# EAGLE schematic rfid-shield (EAGLE 6.5.0)
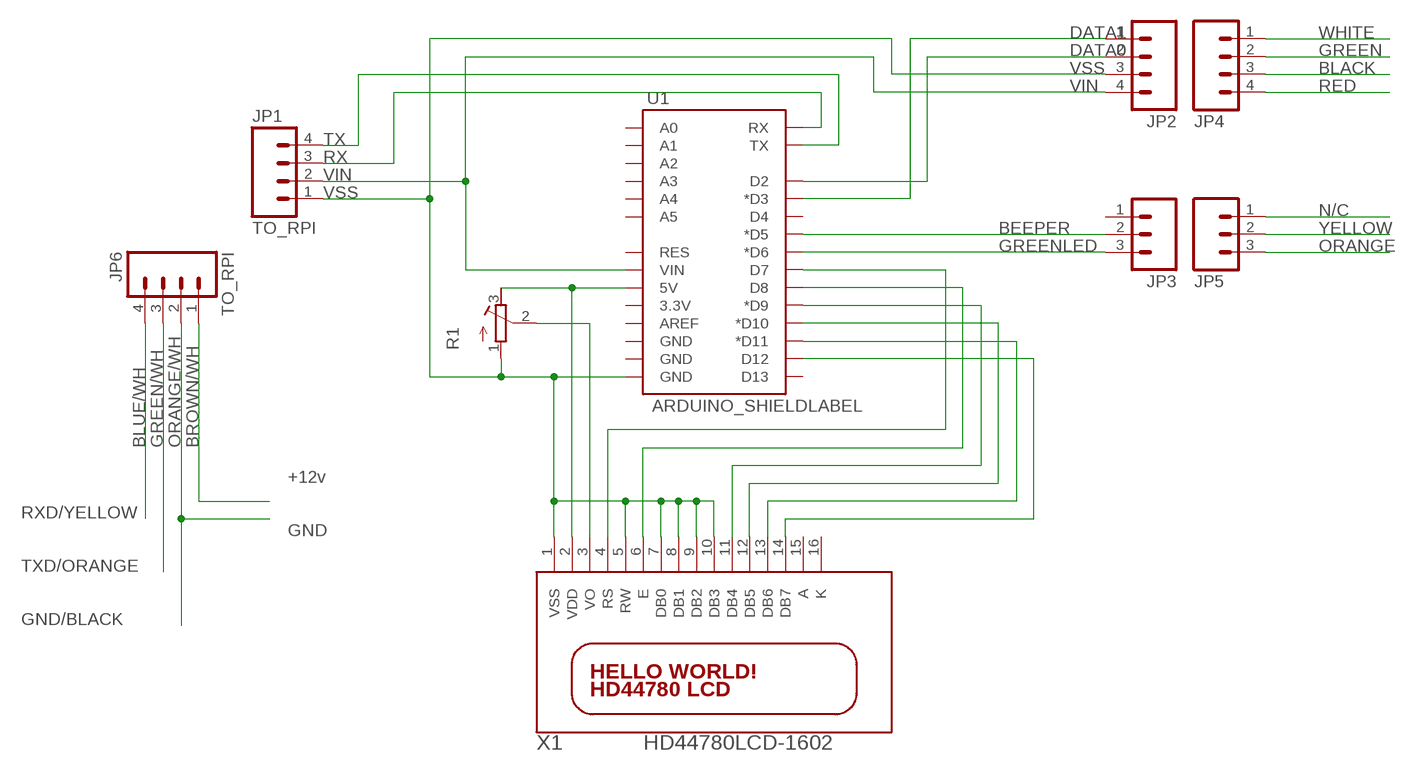
[diagram p0: schematic, sheet 1]

## Parts
JP1  TO_RPI  M041X04_NO_SILK  [1X04_NO_SILK]
JP2  M041X04_NO_SILK  [1X04_NO_SILK]
JP3  M031X03_NO_SILK  [1X03_NO_SILK]
JP4  M041X04_NO_SILK  [1X04_NO_SILK]
JP5  M031X03_NO_SILK  [1X03_NO_SILK]
JP6  TO_RPI  M041X04_NO_SILK  [1X04_NO_SILK]
R1  R-TRIMMCVR42A  [RTRIMCVR42A]
U1  ARDUINO_SHIELDLABEL  [DUEMILANOVE_SHIELD]
X1  HD44780LCD-1602  [LCD1602]

## Nets
BEEPER: JP3.2 U1.D5(*D5)
BLACK: JP4.3
BLUE/WH: JP6.4
BROWN/WH: JP6.1
DATA0: JP2.2 U1.D2
DATA1: JP2.1 U1.D3(*D3)
GREEN: JP4.2
GREEN/WH: JP6.3
GREENLED: JP3.3 U1.D6(*D6)
N$1: U1.D12 X1.14(DB7)
N$2: U1.D11(*D11) X1.13(DB6)
N$3: U1.D10(*D10) X1.12(DB5)
N$4: U1.D9(*D9) X1.11(DB4)
N$5: U1.D8 X1.6(E)
N$6: U1.D7 X1.4(RS)
N$7: R1.2(S) X1.3(VO)
N/C: JP5.1
ORANGE: JP5.3
ORANGE/WH: JP6.2
RED: JP4.4
RX: JP1.3 U1.RX
TX: JP1.4 U1.TX
VDD: R1.3(E) U1.5V X1.2(VDD)
VIN: JP1.2 JP2.4 U1.VIN
VSS: JP1.1 JP2.3 R1.1(A) U1.GND@0(GND) X1.1(VSS) X1.5(RW) X1.7(DB0) X1.8(DB1) X1.9(DB2) X1.10(DB3)
WHITE: JP4.1
YELLOW: JP5.2
Unconnected: JP3.1 U1.3.3V U1.A0 U1.A1 U1.A2 U1.A3 U1.A4 U1.A5 U1.AREF U1.D4 U1.D13 U1.GND@1(GND) U1.GND@2(GND) U1.RES X1.15(A) X1.16(K)

## Notes on the sheet
- +12v
- RXD/YELLOW
- GND
- TXD/ORANGE
- GND/BLACK

## Library data of the parts
JP1 JP2 JP4 JP6 = SparkFun-Connectors:M04: Header 4 Standard 4-pin 0.1" header. Use with straight break away headers (SKU : PRT-00116), right angle break away headers (PRT-00553), swiss pins (PRT-00743), machine pins (PRT-00117), and female headers (PRT-00115). Molex polarized connector foot print use with SKU : PRT-08231 with associated crimp pins and housings. 1MM SMD Version SKU: PRT-10208
JP3 JP5 = SparkFun-Connectors:M03: Header 3 Standard 3-pin 0.1" header. Use with straight break away headers (SKU : PRT-00116), right angle break away headers (PRT-00553), swiss pins (PRT-00743), machine pins (PRT-00117), and female headers (PRT-00115). Molex polarized connector foot print use with SKU : PRT-08232 with associated crimp pins and housings.
R1 = rcl:R-TRIMM: Trimm resistor
U1 = SparkFun-Boards:ARDUINO_SHIELD: Arduino shield footprint
X1 = adafruit:HD44780LCD: HD44780 LCD Standard character type LCDs, available in sizes from 8x1 to 40x4!